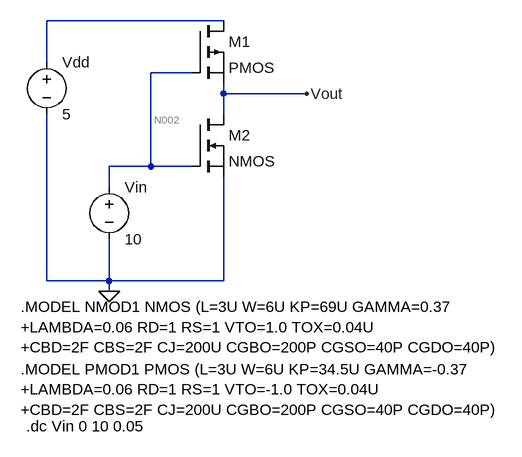
[diagram p0: schematic ee347_prelab2_1d.asc]
ee347_prelab2_1d.asc, the LTspice schematic file:
Version 4
SHEET 1 880 680
WIRE 192 -416 -80 -416
WIRE -80 -352 -80 -416
WIRE 144 -336 80 -336
WIRE 192 -304 192 -320
WIRE 320 -304 192 -304
WIRE 192 -272 192 -304
WIRE 80 -192 80 -336
WIRE 80 -192 16 -192
WIRE 144 -192 80 -192
WIRE 16 -160 16 -192
WIRE -80 -16 -80 -272
WIRE 16 -16 16 -80
WIRE 16 -16 -80 -16
WIRE 192 -16 192 -176
WIRE 192 -16 16 -16
WIRE 16 0 16 -16
FLAG 16 0 0
FLAG 320 -304 Vout
SYMBOL voltage 16 -176 R0
SYMATTR InstName Vin
SYMATTR Value 10
SYMBOL pmos 144 -416 R0
SYMATTR InstName M1
SYMBOL nmos 144 -272 R0
SYMATTR InstName M2
SYMBOL voltage -80 -368 R0
WINDOW 123 0 0 Left 0
WINDOW 39 0 0 Left 0
SYMATTR InstName Vdd
SYMATTR Value 5
TEXT -120 24 Left 2 !.MODEL NMOD1 NMOS (L=3U W=6U KP=69U GAMMA=0.37\n+LAMBDA=0.06 RD=1 RS=1 VTO=1.0 TOX=0.04U\n+CBD=2F CBS=2F CJ=200U CGBO=200P CGSO=40P CGDO=40P)
TEXT -112 208 Left 2 !.dc Vin 0 10 0.05
TEXT -120 120 Left 2 !.MODEL PMOD1 PMOS (L=3U W=6U KP=34.5U GAMMA=-0.37\n+LAMBDA=0.06 RD=1 RS=1 VTO=-1.0 TOX=0.04U\n+CBD=2F CBS=2F CJ=200U CGBO=200P CGSO=40P CGDO=40P)

The netlist it stands for:
* ee347_prelab2_1d.asc
Vin N002 0 10
M1 N001 N002 Vout Vout PMOS
M2 Vout N002 0 0 NMOS
Vdd N001 0 5
.model NMOS NMOS
.model PMOS PMOS
.lib standard.mos
.MODEL NMOD1 NMOS (L=3U W=6U KP=69U GAMMA=0.37
+LAMBDA=0.06 RD=1 RS=1 VTO=1.0 TOX=0.04U
+CBD=2F CBS=2F CJ=200U CGBO=200P CGSO=40P CGDO=40P)
.dc Vin 0 10 0.05
.MODEL PMOD1 PMOS (L=3U W=6U KP=34.5U GAMMA=-0.37
+LAMBDA=0.06 RD=1 RS=1 VTO=-1.0 TOX=0.04U
+CBD=2F CBS=2F CJ=200U CGBO=200P CGSO=40P CGDO=40P)
.backanno
.end

* Results of the author's LTspice run, read from the files saved beside the schematic
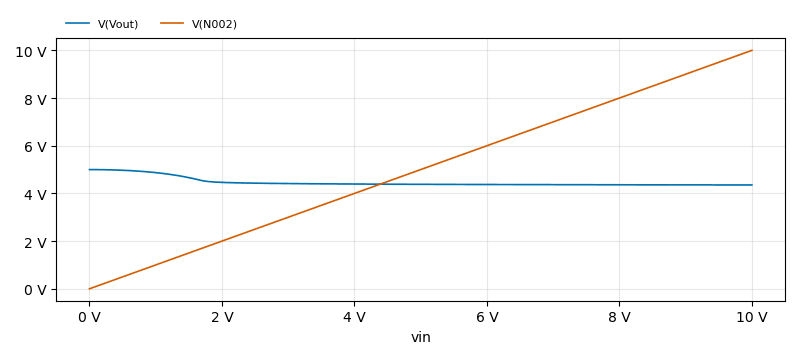
[diagram p1: DC transfer characteristic of ee347_prelab2_1d.asc, plotted from the saved traces]
* DC transfer characteristic, 1 run:
*   V(Vout): 5 V at vin=0 V, 4.355 V at vin=10 V, min 4.355 V, max 5 V
*   V(N002): 0 V at vin=0 V, 10 V at vin=10 V, min 0 V, max 10 V